# EasyEDA schematic SCHEMATIC.json
TITLE: Sheet_1; REV: 1.0; Date: 2025-11-27; Sheet: 1/1; Drawn By: rudravenommishra; Company: Your Company
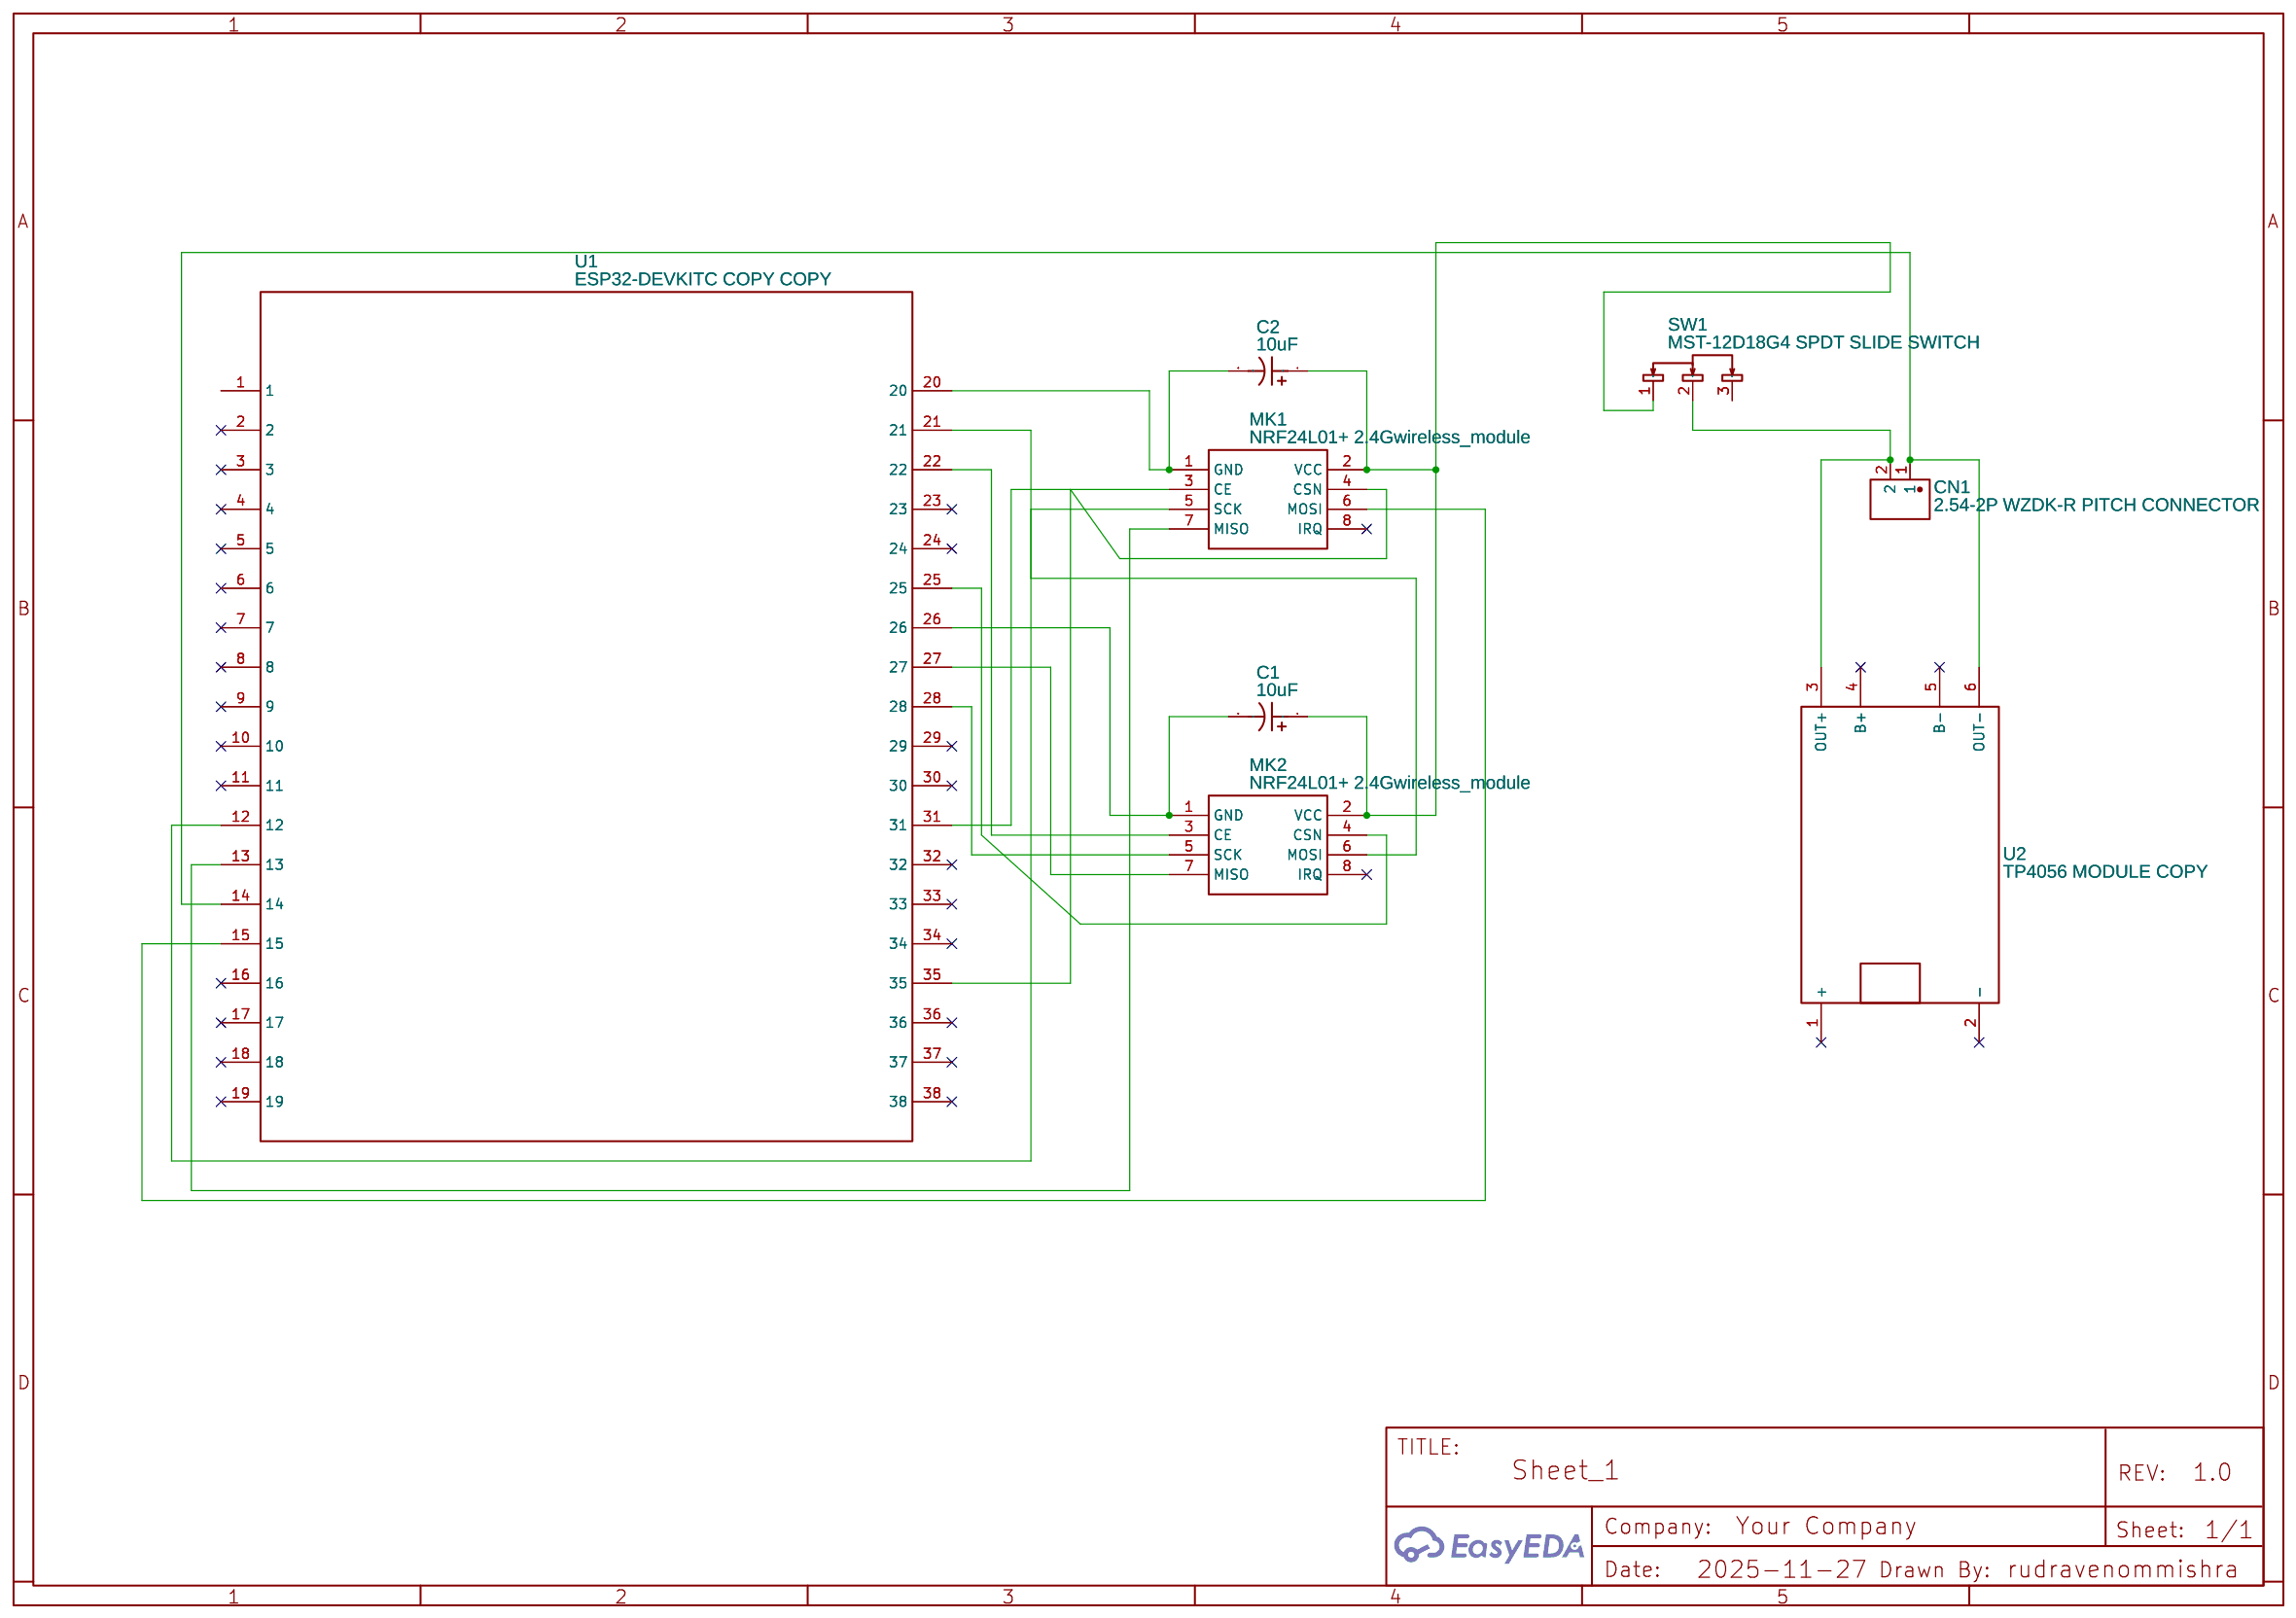
[diagram p0: schematic sheet]

## Parts
C1  10uF  [CAP-TH_BD5.0-P2.00-D0.5-FD_RYHG35V10UF]
C2  10uF  [CAP-TH_BD5.0-P2.00-D0.5-FD_RYHG35V10UF]
CN1  2.54-2P WZDK-R PITCH CONNECTOR  [CONN-TH_2.54-2P-WZDK-R-PITCH-CONNECTOR]
MK1  NRF24L01+ 2.4Gwireless_module  [NRF24L01]
MK2  NRF24L01+ 2.4Gwireless_module  [NRF24L01]
SW1  MST-12D18G4 SPDT SLIDE SWITCH  [SW-SMD_MST-12D18G4-SPDT-SLIDE-SWITCH]
U1  ESP32-DEVKITC COPY COPY  [ESP32-DEVKITC-32D_MODULE_ESP32-DEVKITC-32D]
U2  TP4056 MODULE COPY  [TP4056 MODULE LITHIUM BATTERY CHARGING MODULE]

## Library data of the parts
C1 C2 = RYHG35V10UF5*8: Supplier: LCSC; Supplier Part: C48970423; Manufacturer: HONOR(荣誉); JLCPCB Part Class: Extended Part; Contributor: lcsc
CN1 = 2.54-2P WZDK-R PITCH CONNECTOR: Supplier: LCSC; Supplier Part: C49023803; Manufacturer: SHOU HAN(首韩); Manufacturer Part: 2.54-2P WZDK-R Pitch Connector; JLCPCB Part Class: Extended Part; Contributor: lcsc
MK1 MK2 = NRF24L01+ 2.4Gwireless_module: Supplier Part: C90751; Supplier: LCSC; Manufacturer: Ai-Thinker; Manufacturer Part: NRF24L01+功率加强版绑定2.4Gwireless module; Contributor: baden
SW1 = MST-12D18G4 SPDT SLIDE SWITCH: Supplier: LCSC; Supplier Part: C49023767; Manufacturer: SHOU HAN(首韩); Manufacturer Part: MST-12D18G4 SPDT Slide Switch; JLCPCB Part Class: Extended Part; Contributor: lcsc
U1 = ESP32-DEVKITC COPY COPY: Contributor: Deutz615
U2 = TP4056 MODULE COPY: Contributor: jhon78

## Nets
Net-(C1-1): C1.1 C2.1 MK1.2(VCC) MK2.2(VCC) SW1.1
Net-(C1-2): C1.2 MK2.1(GND) U1.26
Net-(C2-2): C2.2 MK1.1(GND) U1.20
Net-(CN1-1): CN1.1 U1.14 U2.6(OUT-)
Net-(CN1-2): CN1.2 SW1.2 U2.3(OUT+)
Net-(MK1-3): MK1.3(CE) U1.31
Net-(MK1-4): MK1.4(CSN) U1.35
Net-(MK1-5): MK1.5(SCK) U1.12
Net-(MK1-6): MK1.6(MOSI) U1.15
Net-(MK1-7): MK1.7(MISO) U1.13
Net-(MK2-3): MK2.3(CE) U1.22
Net-(MK2-4): MK2.4(CSN) U1.25
Net-(MK2-5): MK2.5(SCK) U1.28
Net-(MK2-6): MK2.6(MOSI) U1.21
Net-(MK2-7): MK2.7(MISO) U1.27

Not connected (* = marked no-connect by the designer): MK1 8(IRQ)*; MK2 8(IRQ)*; SW1 3; U1 1 2* 3* 4* 5* 6* 7* 8* 9* 10* 11* 16* 17* 18* 19* 23* 24* 29* 30* 32* 33* 34* 36* 37* 38*; U2 1(+)* 2(-)* 4(B+)* 5(B-)*
